# Altium project brakelight_jacob.PrjPcb
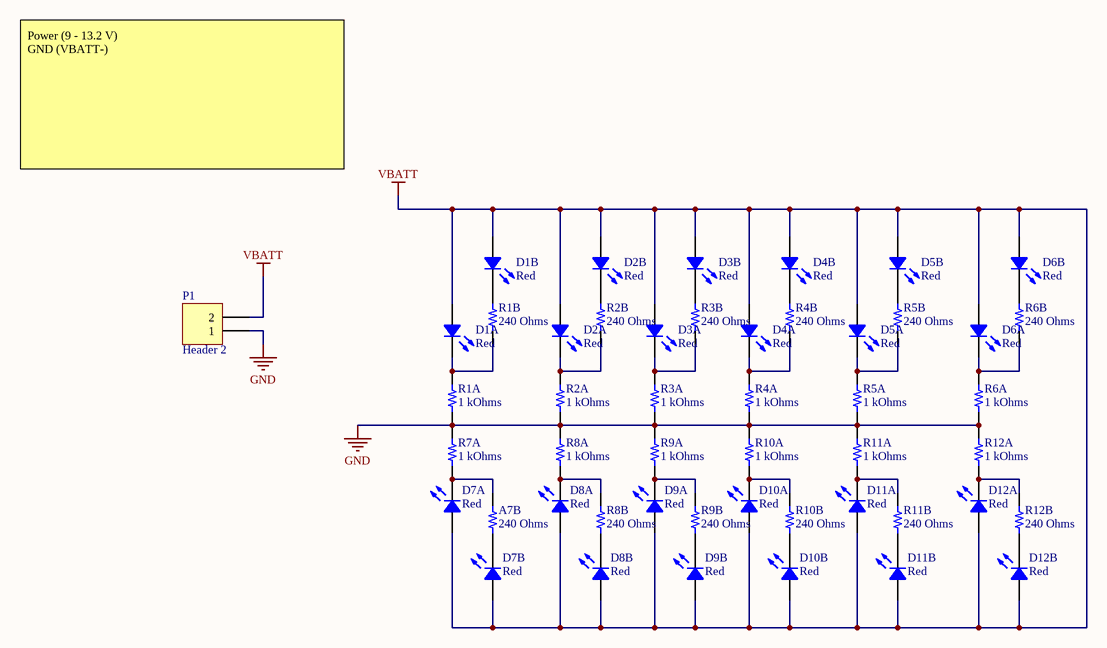
[diagram p0: TOP.SchDoc]
1 sheet, 49 parts. Net scope: global (net labels, ports and power ports of the same name join across sheets).

## Sheet TOP.SchDoc: =DocumentName
size A4; Organization: Queen's Formula SAE; Address1: 130 Stuart St, Kingston; Address2: Ontario; Address3: Canada; Address4: K7L 2V9; DocumentNumber: 1; Revision: 0; SheetNumber: 1; SheetTotal: 1

### Parts
A7B  240 Ohms  [RES 0402_1005]
D1A  Red  [LED 1206_3216 RED]
D1B  Red  [LED 1206_3216 RED]
D2A  Red  [LED 1206_3216 RED]
D2B  Red  [LED 1206_3216 RED]
D3A  Red  [LED 1206_3216 RED]
D3B  Red  [LED 1206_3216 RED]
D4A  Red  [LED 1206_3216 RED]
D4B  Red  [LED 1206_3216 RED]
D5A  Red  [LED 1206_3216 RED]
D5B  Red  [LED 1206_3216 RED]
D6A  Red  [LED 1206_3216 RED]
D6B  Red  [LED 1206_3216 RED]
D7A  Red  [LED 1206_3216 RED]
D7B  Red  [LED 1206_3216 RED]
D8A  Red  [LED 1206_3216 RED]
D8B  Red  [LED 1206_3216 RED]
D9A  Red  [LED 1206_3216 RED]
D9B  Red  [LED 1206_3216 RED]
D10A  Red  [LED 1206_3216 RED]
D10B  Red  [LED 1206_3216 RED]
D11A  Red  [LED 1206_3216 RED]
D11B  Red  [LED 1206_3216 RED]
D12A  Red  [LED 1206_3216 RED]
D12B  Red  [LED 1206_3216 RED]
P1  Header 2  [HDR1X2]
R1A  1 kOhms  [RES 0402_1005]
R1B  240 Ohms  [RES 0402_1005]
R2A  1 kOhms  [RES 0402_1005]
R2B  240 Ohms  [RES 0402_1005]
R3A  1 kOhms  [RES 0402_1005]
R3B  240 Ohms  [RES 0402_1005]
R4A  1 kOhms  [RES 0402_1005]
R4B  240 Ohms  [RES 0402_1005]
R5A  1 kOhms  [RES 0402_1005]
R5B  240 Ohms  [RES 0402_1005]
R6A  1 kOhms  [RES 0402_1005]
R6B  240 Ohms  [RES 0402_1005]
R7A  1 kOhms  [RES 0402_1005]
R8A  1 kOhms  [RES 0402_1005]
R8B  240 Ohms  [RES 0402_1005]
R9A  1 kOhms  [RES 0402_1005]
R9B  240 Ohms  [RES 0402_1005]
R10A  1 kOhms  [RES 0402_1005]
R10B  240 Ohms  [RES 0402_1005]
R11A  1 kOhms  [RES 0402_1005]
R11B  240 Ohms  [RES 0402_1005]
R12A  1 kOhms  [RES 0402_1005]
R12B  240 Ohms  [RES 0402_1005]

### Nets
GND: P1.1 R1A.1 R2A.1 R3A.1 R4A.1 R5A.1 R6A.1 R7A.2 R8A.2 R9A.2 R10A.2 R11A.2 R12A.2
VBATT: D1A.1 D1B.1 D2A.1 D2B.1 D3A.1 D3B.1 D4A.1 D4B.1 D5A.1 D5B.1 D6A.1 D6B.1 D7A.1 D7B.1 D8A.1 D8B.1 D9A.1 D9B.1 D10A.1 D10B.1 D11A.1 D11B.1 D12A.1 D12B.1 P1.2
NetA7B_1: A7B.1 D7B.2
NetA7B_2: A7B.2 D7A.2 R7A.1
NetD1A_2: D1A.2 R1A.2 R1B.1
NetD1B_2: D1B.2 R1B.2
NetD2A_2: D2A.2 R2A.2 R2B.1
NetD2B_2: D2B.2 R2B.2
NetD3A_2: D3A.2 R3A.2 R3B.1
NetD3B_2: D3B.2 R3B.2
NetD4A_2: D4A.2 R4A.2 R4B.1
NetD4B_2: D4B.2 R4B.2
NetD5A_2: D5A.2 R5A.2 R5B.1
NetD5B_2: D5B.2 R5B.2
NetD6A_2: D6A.2 R6A.2 R6B.1
NetD6B_2: D6B.2 R6B.2
NetD8A_2: D8A.2 R8A.1 R8B.2
NetD8B_2: D8B.2 R8B.1
NetD9A_2: D9A.2 R9A.1 R9B.2
NetD9B_2: D9B.2 R9B.1
NetD10A_2: D10A.2 R10A.1 R10B.2
NetD10B_2: D10B.2 R10B.1
NetD11A_2: D11A.2 R11A.1 R11B.2
NetD11B_2: D11B.2 R11B.1
NetD12A_2: D12A.2 R12A.1 R12B.2
NetD12B_2: D12B.2 R12B.1

### Notes on the sheet
- Power (9 - 13.2 V)
  GND (VBATT-)
- Title
- Size:
- Date:
- A4
- Number:
- Time:
- Revision:
- Sheet
- of
- File:

### Library data of the parts
A7B R1B R2B R3B R4B R5B R6B R8B R9B R10B R11B R12B = RC0402FR-13240RL: RES 240 OHM 1% 1/16W 0402; Manufacturer: Yageo; Power (Watts): 0.063W, 1/16W; Temperature Coefficient: ±100ppm/°C; Part Number: RC0402FR-13240RL; Value: 240 Ohms; ComponentLink1Description: Datasheet; ComponentLink1URL: https://www.yageo.com/upload/media/product/productsearch/datasheet/rchip/PYu-RC_Group_51_RoHS_L_11.pdf; ComponentLink2Description: DigiKey Link; ComponentLink2URL: https://www.digikey.com/en/products/detail/yageo/RC0402FR-13240RL/13694164; Composition: Thick Film; Device Package: 0402 (1005 Metric); Features: Moisture Resistant; Height - Seated (Max): 0.016" (0.40mm); LastUpdated: 9/19/2022 1:13:42 PM; Lifecycle Status: Active; Minimum Order: 50000; Number of Terminations: 2; Operating Temperature: -55°C ~ 155°C; Package / Case: 0402 (1005 Metric); PartId: 64892; Part Status: Active; Price: 0; Resistance: 240 Ohms; Series: RC_L; Size / Dimension: 0.039" L x 0.020" W (1.00mm x 0.50mm); Supplier 1: DigiKey; Supplier Part Number 1: 13-RC0402FR-13240RLTR-ND; Supplier Device Package: 0402; Tolerance: ±1%
D1A D1B D2A D2B D3A D3B D4A D4B D5A D5B D6A D6B D7A D7B D8A D8B D9A D9B D10A D10B D11A D11B D12A D12B = APTR3216SECK/J3-PRV: LED SMD; Manufacturer: Kingbright; Configuration: 1206; Current - Test: 20mA; Lens Color: Colorless; Lens Size: 1.60mm x 1.40mm; Lens Style: Rectangle with Flat Top; Lens Transparency: Clear; Millicandela Rating: 350mcd; Viewing Angle: 140°; Voltage - Forward (Vf) (Typ): 2.2V; Wavelength - Dominant: 625nm; Wavelength - Peak: 640nm; Part Number: APTR3216SECK/J3-PRV; Color: Red; ComponentLink1Description: Datasheet; ComponentLink1URL: http://www.kingbrightusa.com/images/catalog/SPEC/APTR3216SECK-J3-PRV.pdf; ComponentLink2Description: DigiKey Link; ComponentLink2URL: https://www.digikey.com/en/products/detail/kingbright/APTR3216SECK-J3-PRV/10293085; Device Package: 1206 (3216 Metric); Height (Max): 1.25mm; LastUpdated: 2022-09-19 1:50:50 PM; Lifecycle Status: Active; Minimum Order: 1; Mounting Type: Surface Mount; Package / Case: 1206 (3216 Metric); Packaging: TapeAndReel; PartId: 194; Part Status: Active; Price: 0.17; Series: Heli-R; Size / Dimension: 3.20mm L x 1.60mm W; Supplier 1: DigiKey; Supplier Part Number 1: 754-APTR3216SECK/J3-PRVCT-ND; Supplier Device Package: 1206; Value: Red
P1 = Header 2: Header, 2-Pin; LatestRevisionDate: 17-Jul-2002; LatestRevisionNote: Re-released for DXP Platform.; Publisher: Altium Limited
R1A R2A R3A R4A R5A R6A R7A R8A R9A R10A R11A R12A = AT0402BRD071KL: RES SMD 1K OHM 0.1% 1/16W 0402; Manufacturer: Yageo; Power (Watts): 0.063W, 1/16W; Temperature Coefficient: ±25ppm/°C; Part Number: AT0402BRD071KL; Value: 1 kOhms; ComponentLink1Description: Datasheet; ComponentLink1URL: http://www.yageo.com/documents/recent/PYu-AT_51_RoHS_L_5.pdf; ComponentLink2Description: DigiKey Link; ComponentLink2URL: https://www.digikey.com/en/products/detail/yageo/AT0402BRD071KL/5138607; Composition: Thin Film; Device Package: 0402 (1005 Metric); Features: Anti-Sulfur, Automotive AEC-Q200, Moisture Resistant; Height - Seated (Max): 0.014" (0.35mm); LastUpdated: 2022-09-19 1:15:04 PM; Lifecycle Status: Active; Minimum Order: 1; Number of Terminations: 2; Operating Temperature: -55°C ~ 155°C; Package / Case: 0402 (1005 Metric); Packaging: TapeAndReel; PartId: 2462; Part Status: Active; Price: 0.09; Ratings: AEC-Q200; Resistance: 1 kOhms; Series: AT; Size / Dimension: 0.039" L x 0.020" W (1.00mm x 0.50mm); Supplier 1: DigiKey; Supplier Part Number 1: YAG2088CT-ND; Supplier Device Package: 0402; Tolerance: ±0.1%